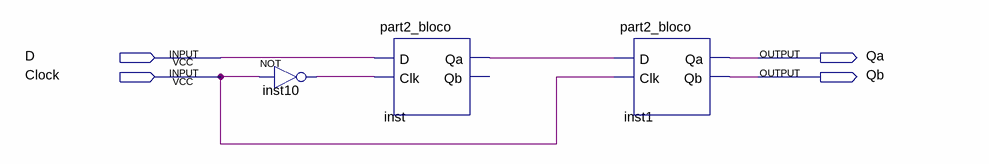
[diagram p0: schematic sheet]
// Quartus schematic part3.bdf as structural Verilog: 3 symbols, 4 pins
module part3 (
  input  D,
  input  Clock,
  output Qa,
  output Qb
);

  wire inst10_out, inst_qa;

  not inst10 (inst10_out, Clock);
  part2_bloco inst (.D(D), .Clk(inst10_out), .Qa(inst_qa));  // open: Qb
  part2_bloco inst1 (.D(inst_qa), .Clk(Clock), .Qa(Qa), .Qb(Qb));
endmodule
